# Altium schematic sheet Sheet_1_2021-12-20.schdoc
size 48 x 29 mm
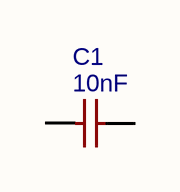
[diagram p0: Sheet_1_2021-12-20.schdoc]

## Parts
C1  10nF  [C0603]

## Nets

Not connected (* = marked no-connect by the designer): C1 1 2

## Library data of the parts
C1 = 10nF: BOM_Manufacturer: YAGEO; BOM_Manufacturer Part: CC0603KRX7R9BB103; nameAlias: Capacitance; BOM_Supplier: LCSC; BOM_Supplier Part: C100042; BOM_JLCPCB Part Class: Extended Part; spicePre: C; spiceSymbolName: CC0603KRX7R9BB103